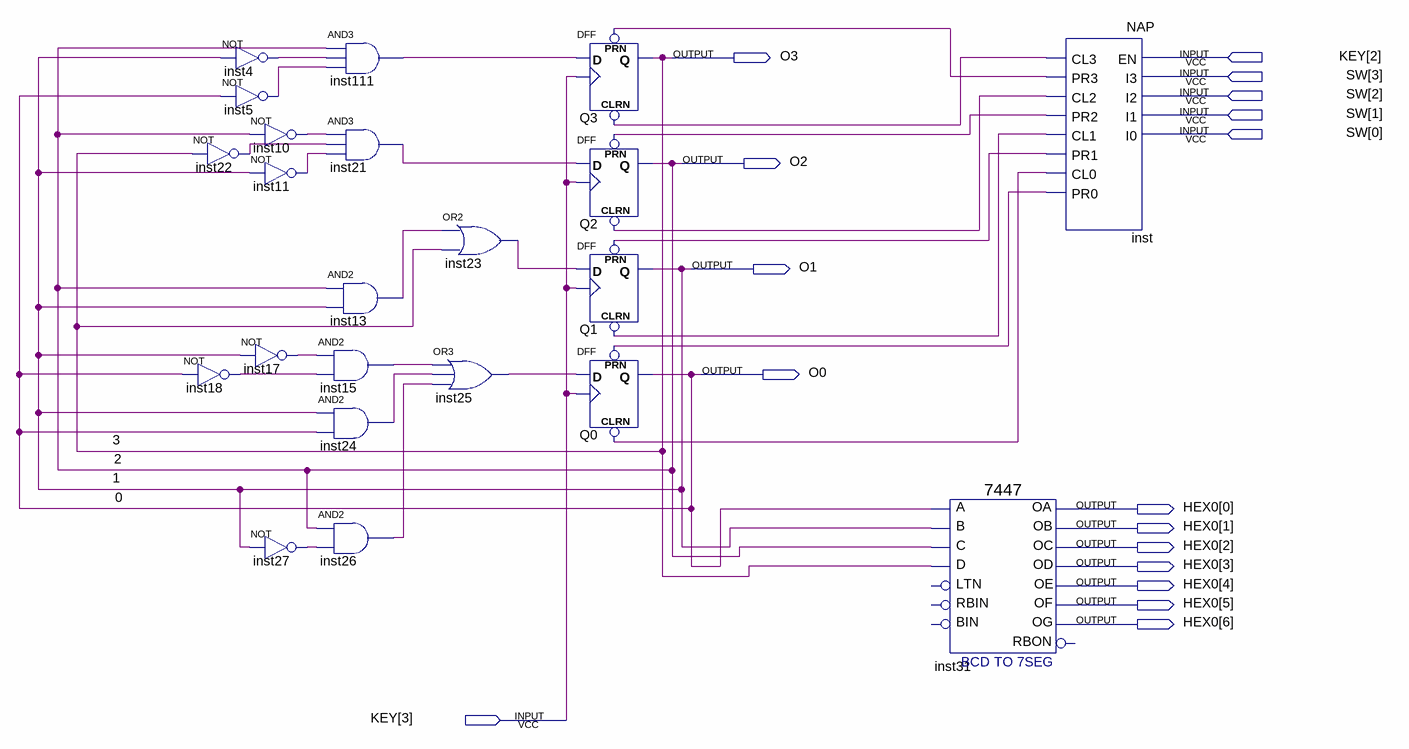
[diagram p0: schematic sheet]
// Quartus schematic Lab1.bdf as structural Verilog: 22 symbols, 17 pins
module Lab1 (
  input  [3:2] KEY,
  input  [3:0] SW,
  output O3,
  output O2,
  output O1,
  output O0,
  output [6:0] HEX0
);

  wire inst4_out, inst5_out, inst10_out, inst11_out, inst13_out, inst15_out, inst17_out, inst18_out,
       inst21_out, inst22_out, inst23_out, inst24_out, inst25_out, inst26_out, inst27_out, inst111_out,
       inst_cl0, inst_cl1, inst_cl2, inst_cl3, inst_pr0, inst_pr1, inst_pr2, inst_pr3;

  not inst22 (inst22_out, O3);
  not inst18 (inst18_out, O0);
  not inst4 (inst4_out, O1);
  not inst5 (inst5_out, O0);
  not inst10 (inst10_out, O2);
  not inst11 (inst11_out, O1);
  not inst17 (inst17_out, O1);
  not inst27 (inst27_out, O1);
  and inst111 (inst111_out, O2, inst4_out, inst5_out);
  and inst21 (inst21_out, inst10_out, inst22_out, inst11_out);
  and inst13 (inst13_out, O2, O1);
  and inst15 (inst15_out, inst17_out, inst18_out);
  and inst24 (inst24_out, O1, O0);
  and inst26 (inst26_out, O2, inst27_out);
  or inst23 (inst23_out, inst13_out, O3);
  or inst25 (inst25_out, inst15_out, inst24_out, inst26_out);
  DFF Q3 (.CLRN(inst_cl3), .CLK(KEY[3]), .D(inst111_out), .PRN(inst_pr3), .Q(O3));
  DFF Q2 (.CLRN(inst_cl2), .CLK(KEY[3]), .D(inst21_out), .PRN(inst_pr2), .Q(O2));
  DFF Q1 (.CLRN(inst_cl1), .CLK(KEY[3]), .D(inst23_out), .PRN(inst_pr1), .Q(O1));
  DFF Q0 (.CLRN(inst_cl0), .CLK(KEY[3]), .D(inst25_out), .PRN(inst_pr0), .Q(O0));
  \7447  inst31 (
    .B(O1), .C(O2), .D(O3), .A(O0), .OB(HEX0[1]), .OC(HEX0[2]), .OE(HEX0[4]), .OD(HEX0[3]), .OF(HEX0[5]),
    .OG(HEX0[6]), .OA(HEX0[0]));  // open: LTN, RBIN, BIN, RBON
  NAP inst (
    .EN(KEY[2]), .I3(SW[3]), .I2(SW[2]), .I1(SW[1]), .I0(SW[0]), .CL3(inst_cl3), .PR3(inst_pr3),
    .CL2(inst_cl2), .PR2(inst_pr2), .CL1(inst_cl1), .PR1(inst_pr1), .CL0(inst_cl0), .PR0(inst_pr0));

  // Other names for the same wires on the sheet: 0 = O0; 1 = O1; 2 = O2; 3 = O3
endmodule
